# Altium schematic sheet Power Amp.SchDoc
size A; DrawnBy: William Meng
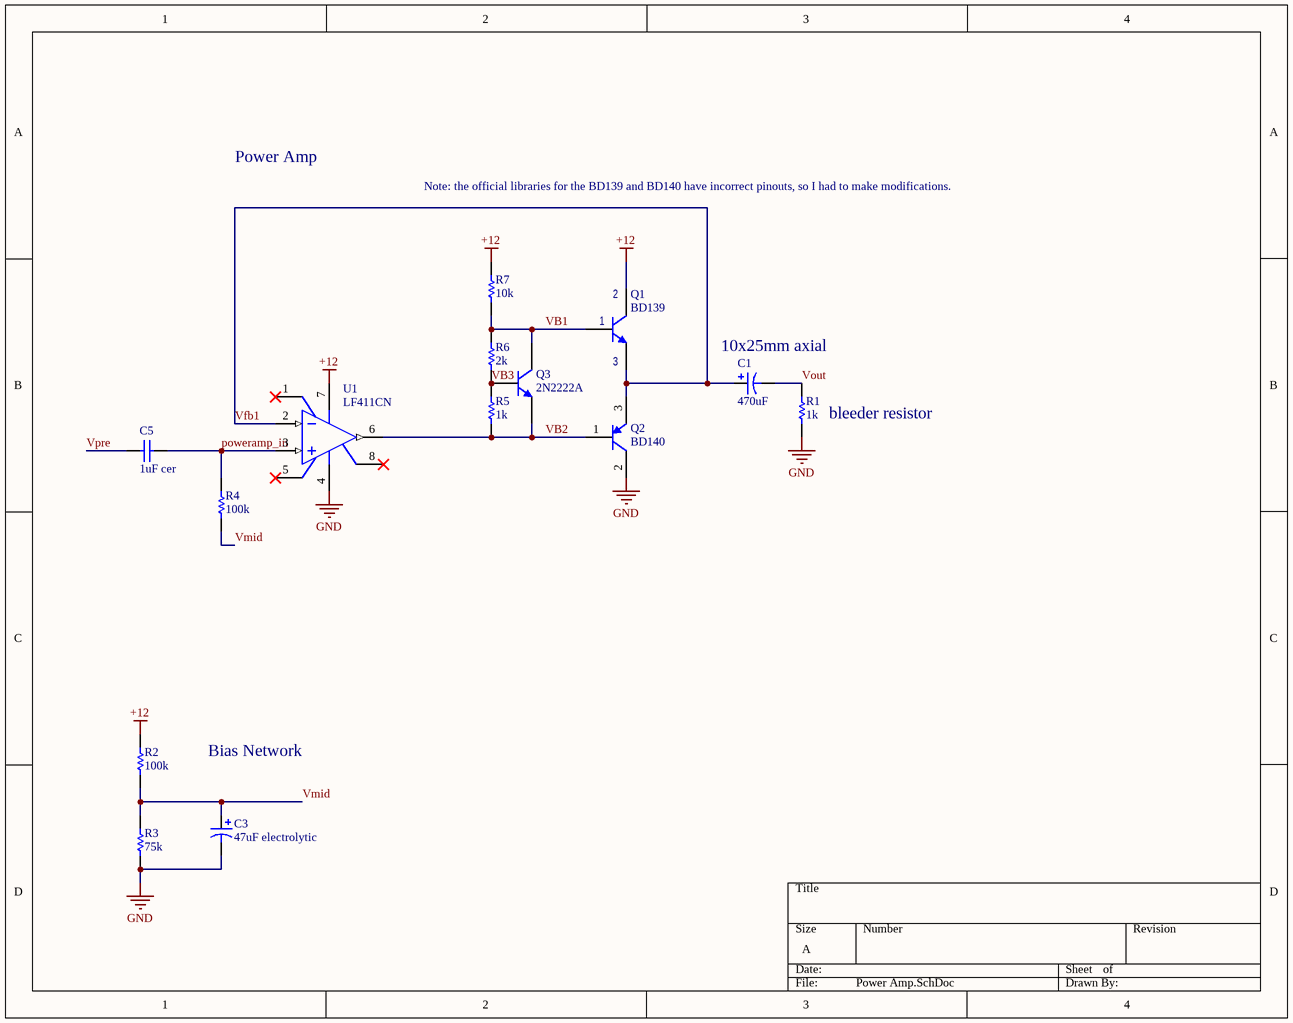
[diagram p0: Power Amp.SchDoc]

## Parts
C1  470uF  [Capacitor]
C3  47uF electrolytic  [PCB-bs2nfpedd8vjo8odb39w-1]
C5  1uF cer  [PCB-19304320-1]
Q1  BD139  [PCB-vxsgokorrilsux2zr6a3-1]
Q2  BD140  [ONSC-TO-225-3-77-09]
Q3  2N2222A  [PCB-il5alzs33b9y8p1mx0ke-1]
R1  1k  [PCB-ufx52wqpb97u1085hkka-1]
R2  100k  [PCB-ufx52wqpb97u1085hkka-1]
R3  75k  [PCB-ufx52wqpb97u1085hkka-1]
R4  100k  [PCB-ufx52wqpb97u1085hkka-1]
R5  1k  [PCB-ufx52wqpb97u1085hkka-1]
R6  2k  [PCB-ufx52wqpb97u1085hkka-1]
R7  10k  [PCB-ufx52wqpb97u1085hkka-1]
U1  LF411CN  [N08E]

## Nets
+12: Q1.2(C) R2.2 R7.2 U1.7(V+)
GND: C3.2 Q2.2(C) R1.1 R3.1 U1.4(V-)
poweramp_in: C5.2 R4.2 U1.3(IN+)
VB1: Q1.1(B) Q3.3(C) R6.2 R7.1
VB2: Q2.1(B) Q3.1(E) R5.1 U1.6(OUT)
VB3: Q3.2(B) R5.2 R6.1
Vfb1: C1.1 Q1.3(E) Q2.3(E) U1.2(IN-)
Vmid: C3.1 R2.1 R3.2 R4.1
Vout: C1.2 R1.2
Vpre: C5.1

Not connected (* = marked no-connect by the designer): U1 1(BAL)* 5(BAL)* 8(NC)*

## Notes on the sheet
- Power Amp
- Note: the official libraries for the BD139 and BD140 have incorrect pinouts, so I had to make modifications.
- 10x25mm axial
- (near R1) bleeder resistor
- Bias Network

## Library data of the parts
C1 = CMP-76c7be02e5fba900-1: Cap Aluminum 33uF 100V 20% (10 X 25mm) Axial 3.4 Ohm 140mA 4000h 125°C T/R; OctopartID: 76c7be02e5fba900
C3 = EEU-FC1H470: Cap Aluminum Lytic 47uF 50V 20% (6.3 X 11.2mm) Radial 2.5mm 260mA 1000h 105C Automotive Bulk; Capacitance: 47.0 F; Dielectric Material: Aluminum Electrolytic; Voltage Rating (DC): 50.0 V; Lead-Free Status: Lead Free; Mounting Style: Through Hole; Lifecycle Status: Not Listed by Manufacturer; Manufacturer Part Number: EEU-FC1H470; Packaging: Bulk; Capacitance Tolerance: ±20%; Number of Pins: 2; OctopartID: 6ed4a5842ea2b113; Size-Length: 11.2 mm; RoHS: Compliant; REACH SVHC Compliance: No SVHC; Size-Diameter: 6.30 mm; Octopart URL: http://octopart.com/eeu-fc1h470-panasonic-39478544; Size-Height: 11.2 mm
C5 = C330C105K5R5TA: Capacitor; Ceramic; Cap 1.00uF; Tol 10%; Radial; Vol-Rtg 50V; Lead-Free Status: Lead Free; Capacitance: 1.00 µF; Voltage Rating (DC): 50.0 V; Lead Length: 7.00 mm; Dielectric Characteristic: X7R; Size-Height: 9.14 mm; Number of Pins: 2; Mounting Style: Through Hole; OctopartID: bb267075e97664e1; REACH SVHC Compliance: No SVHC; Octopart URL: http://octopart.com/c330c105k5r5ta-kemet-39417654; Packaging: Bulk; Capacitance Tolerance: ±10%; Manufacturer Part Number: C330C105K5R5TA; Size-Length: 7.62 mm; RoHS: Compliant
Q1 = STMicroelectronics BD139-4: BD139 Series NPN 80 V 1.5 A Complementary Low Voltage Transistor - SOT-32
Q2 = BD140-3: Plastic Medium-Power Silicon PNP Transistor, 3-Pin TO-225, Bulk Box; Current Rating: 1.5 A; Lead-Free Status: Contains Lead; Voltage Rating (DC): -80.0 V; Manufacturer Part Number: BD140; Lifecycle Status: Not Listed by Manufacturer; Mounting Style: Through Hole; Octopart Url: https://octopart.com/bd140-on+semiconductor-354679; OctopartID: 29e8e0e765f9f62f; Packaging: Bulk; RoHS: Compliant
Q3 = P2N2222AG: Transistor, NPN, 40v, To-92; Lead-Free Status: Lead Free; Polarity: NPN, N-Channel; Voltage Rating (DC): 40.0 V; Octopart URL: https://octopart.com/p2n2222ag-on+semiconductor-55396558; Number of Pins: 3
R1-R7 = CFR50J10K: Through Hole Carbon Film Resistor, CFR Series, 10 kohm, 500 mW, - 5%, 350 V, Axial Leaded
U1 = LF411CN: Low Offset, Low Drift JFET Input Operational Amplifier, 8-pin MDIP; Bandwidth: 4000000.0 Hz; Input Offset Drift: 7e-06 V/K; Lead-Free Status: Contains Lead; Number of Channels: 1; Output Current: 0.025 A; Slew Rate: 15.0 V/μs; Supply Voltage (DC): 44.0 V; Case/Package: DIP; Gain Bandwidth Product: 4000000.0 Hz; Lifecycle Status: Active; Mounting Style: Through Hole; Number of Pins: 8; Octopart Url: https://octopart.com/lf411cn-texas+instruments-24728701; OctopartID: f68f3efc87942948; Packaging: Rail; REACH SVHC Compliance: No SVHC; RoHS: Non-Compliant; Manufacturer Part Number: LF411CN